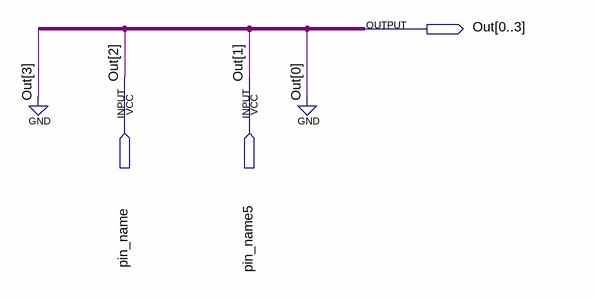
[diagram p0: schematic sheet]
// Quartus schematic gambi.bdf as structural Verilog: 0 symbols, 3 pins
module gambi (
  input  pin_name,
  input  pin_name5,
  output [0:3] Out
);


  assign Out = {1'b0, pin_name5, pin_name, 1'b0};
endmodule
